# Altium schematic sheet FUSE_AND_VI_SENSE.SchDoc
size B; SheetNumber: 19; SheetTotal: 19
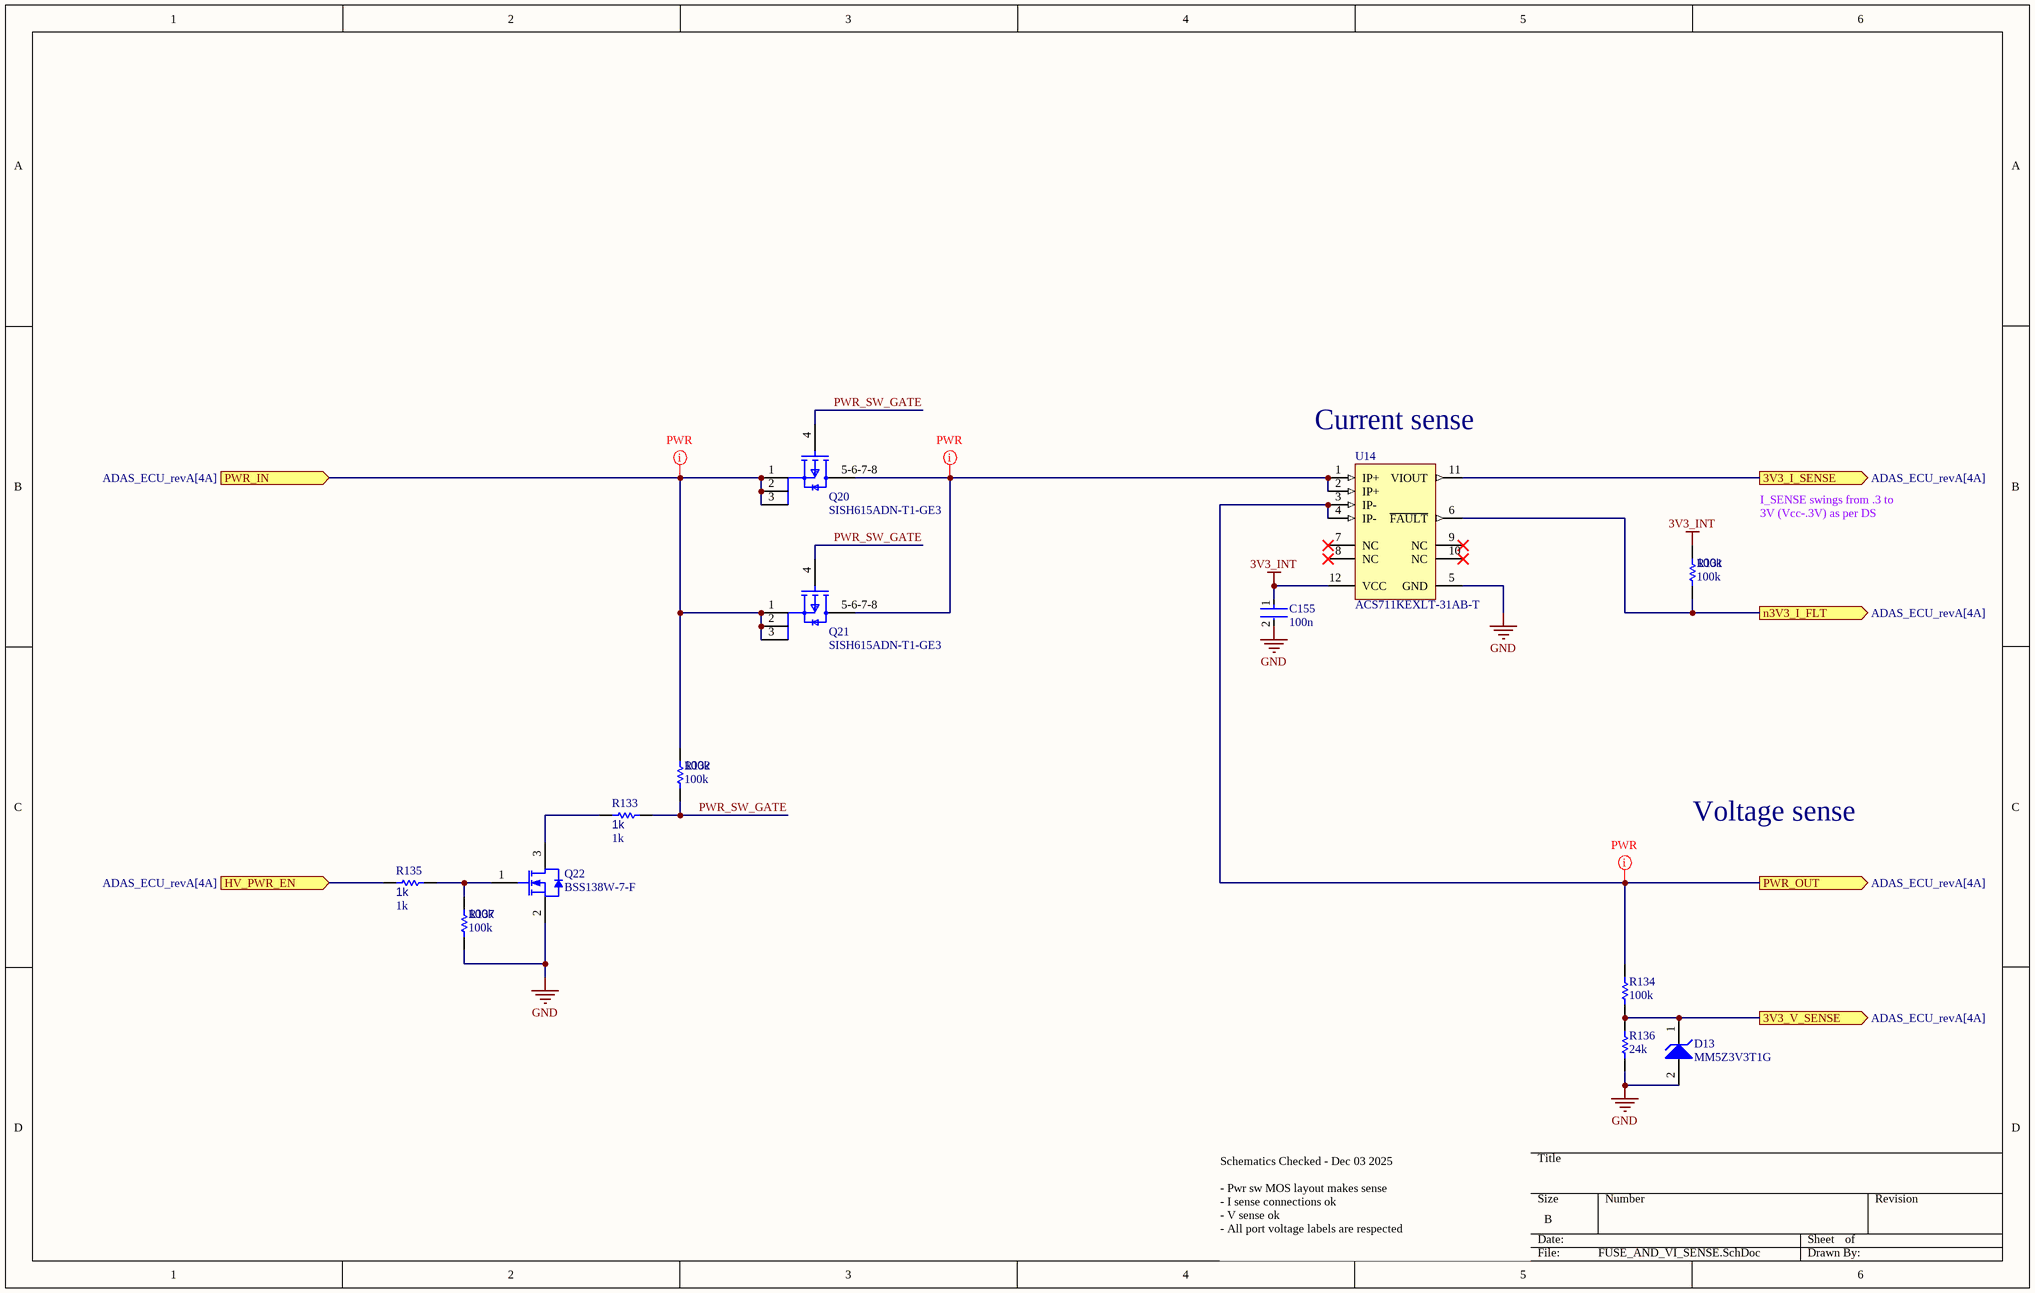
[diagram p0: FUSE_AND_VI_SENSE.SchDoc]

## Parts
C155  100n  [FP-0402-L_1_0_0_05-W_0_5-IPC_A]
D13  MM5Z3V3T1G  [ONSC-SOD-523-2-502-01_V]
Q20  SISH615ADN-T1-GE3  [SISH615ADN-T1-GE3-Footprint-1]
Q21  SISH615ADN-T1-GE3  [SISH615ADN-T1-GE3-Footprint-1]
Q22  BSS138W-7-F  [DIOD-SOT323-3_V]
R131  100k  [R0603B]
R132  100k  [R0603B]
R133  1k  [R0603B]
R134  100k  [R0603B]
R135  1k  [R0603B]
R136  24k  [R0603B]
R137  100k  [R0603B]
U14  ACS711KEXLT-31AB-T  [ALEG-EX-12_V]

## Ports
3V3_I_SENSE (out, see ADAS_ECU_revA[4A]), 3V3_V_SENSE (out, see ADAS_ECU_revA[4A]), HV_PWR_EN (in, see ADAS_ECU_revA[4A]), n3V3_I_FLT (out, see ADAS_ECU_revA[4A]), PWR_IN (in, see ADAS_ECU_revA[4A]), PWR_OUT (out, see ADAS_ECU_revA[4A])

## Nets
3V3_INT: C155.1 R131.2 U14.12(VCC)
GND: C155.2 D13.2(A) Q22.2(S) R136.1 R137.1 U14.5(GND)
3V3_I_SENSE: U14.11(VIOUT) ; port 3V3_I_SENSE
3V3_V_SENSE: D13.1(K) R134.1 R136.2 ; port 3V3_V_SENSE
HV_PWR_EN: R135.1 ; port HV_PWR_EN
n3V3_I_FLT: R131.1 U14.6(~{FAULT}) ; port n3V3_I_FLT
PWR_IN: Q20.1(S) Q20.2(S) Q20.3(S) Q21.1(S) Q21.2(S) Q21.3(S) R132.2 ; port PWR_IN
PWR_OUT: R134.2 U14.3(IP-) U14.4(IP-) ; port PWR_OUT
PWR_SW_GATE: Q20.4(G) Q21.4(G) R132.1 R133.2
NetQ20_5-6-7-8: Q20.5-6-7-8(D) Q21.5-6-7-8(D) U14.1(IP+) U14.2(IP+)
NetQ22_1: Q22.1(G) R135.2 R137.2
NetQ22_3: Q22.3(D) R133.1

Not connected (* = marked no-connect by the designer): U14 7(NC)* 8(NC)* 9(NC)* 10(NC)*

## Layout directives
net class PWR: NetQ20_5-6-7-8, PWR_IN, PWR_OUT

## Notes on the sheet
- (near U14) Current sense
- I_SENSE swings from .3 to 3V (Vcc-.3V) as per DS
- Voltage sense
- Schematics Checked - Dec 03 2025
  - Pwr sw MOS layout makes sense
  - I sense connections ok
  - V sense ok
  - All port voltage labels are respected

## Library data of the parts
C155 = CMP-001-00058-1: LARGE PADS, 0402 CAP, CHANGE COMMENT TO MATCH REAL P/N; Capacitor Type: Ceramic; Min Operating Temperature: -55°C; Mounting Technology: Surface Mount; Pins: 2; Case/Package: 0402; RoHS Compliant: Yes; Max Operating Temperature: 85°C
D13 = CMP-1060-00750-1: Zener Voltage Regulator, 500 mW, 2-Pin SOD-523, Pb-Free, Tape and Reel; Manufacturer: On Semiconductor; P Max (W): 0.5; VZ Typ (V): 3.3; RoHS: Pb-Free; ComponentLink2Description: Datasheet; PackageReference: SOD-523-2-502-01; DatasheetVersion: Rev. 10; ComponentLink1Description: Manufacturer URL; PackageVersion: Rev. E, 09/2010; ComponentLink3URL: http://www.onsemi.com/pub_link/Collateral/502-01.PDF; ComponentLink2URL: http://www.onsemi.cn/pub_link/Collateral/MM5Z2V4T1-D.PDF; Mounting Technology: Surface Mount; PartNumber: MM5Z3V3T1G; Packing: Tape and Reel; PackageDescription: 2-Pin SOD, Body 1.2 x 0.8 mm; ComponentLink1URL: http://www.onsemi.com/; ComponentLink3Description: Package Specification
Q20 Q21 = CMP-013-00018-2: Trans MOSFET P-CH 20V 22.1A 8-Pin PowerPAK 1212 EP T/R; Source: SISH615ADN-T1-GE3.SchLib; Design Item ID: CMP-013-00036-4; Component Type: Standard; Pins: 5
Q22 = CMP-2000-05968-1: N-Channel Enhancement Mode Mosfet, 50 V, 200 mA, -55 to 150 degC, 6-Pin SOT-323, RoHS, Tape and Reel; Typical Turn-Off Delay Time: 20ns; Number of Channels: 1Channel; Type: EnhancementModeFieldEffectTransistor; Brand: DiodesIncorporated; Vds - Drain-Source Breakdown Voltage: 75V; Vgs - Gate-Source Voltage: 20V; Rds On - Drain-Source Resistance: 1.4Ohms; Transistor Type: 1N-Channel; Configuration: Single; Unit Weight: 0.000212oz; Pd - Power Dissipation: 200mW; Id - Continuous Drain Current: 200mA; Forward Transconductance - Min: 0.1S; Manufacturer URL: http://www.diodes.com/; Series: BSS138; Package Description: 3-Pin Small Outline Transistor, Body 2 x 1.25 mm, Pitch 0.65 mm; Mounting Technology: SurfaceMount; Product Category: MOSFET; RoHS: True; Maximum Operating Temperature: +150C; Height: 1mm; Length: 2.2mm; Technology: Si; Width: 1.35mm; Datasheet URL: http://www.diodes.com/_files/datasheets/ds30206.pdf; Manufacturer: DiodesIncorporated; Package / Case: SOT-323-3; Typical Turn-On Delay Time: 20ns; Transistor Polarity: N-Channel; Factory Pack Quantity: 3000; Packaging: Reel; Product: MOSFETSmallSignal; Datasheet Version: Rev. 11-2, 09/2013; Package Reference: SOT323; Minimum Operating Temperature: -55C; Mounting Style: SMD/SMT; Channel Mode: Enhancement
R131-R137 = CMP-009-00002-14: Resistor
  R131 R132 R134 R137: Value: 100k
  R133 R135: Value: 1k
  R136: Value: 24k
U14 = CMP-1557-00002-1: Hall Effect Linear Current Sensor with Overcurrent Fault Output for <100 V Isolation Applications, 3 to 5.5 V, -31 to 31 A IP, -40 to 125 degC, 12-Pin QFN (EX), RoHS, Tape and Reel; IP Max: 31 A; VCC Min: 3 V; -3dB Bandwidth: 0.1 MHz; VCC Max: 5.5 V; IP Min: -31 A; Mounting Technology: Surface Mount; DatasheetVersion: Rev. 3; Temperature Min: -40 degC; ComponentLink1Description: Manufacturer URL; Packing: Tape and Reel; PartNumber: ACS711KEXLT-31AB-T; Temperature Max: 125 degC; ComponentLink2Description: Datasheet; ComponentLink3Description: Package Specification; RoHS: TRUE; ComponentLink1URL: http://www.allegromicro.com/; ComponentLink2URL: http://www.allegromicro.com/~/media/Files/Datasheets/ACS711-Datasheet.ashx?la=en; PackageDescription: 12-Pin Quad Flat No-Lead, Body 3 x 3 mm, Height 0.8 mm; ComponentLink3URL: http://www.allegromicro.com/~/media/Files/Datasheets/ACS711-Datasheet.ashx?la=en